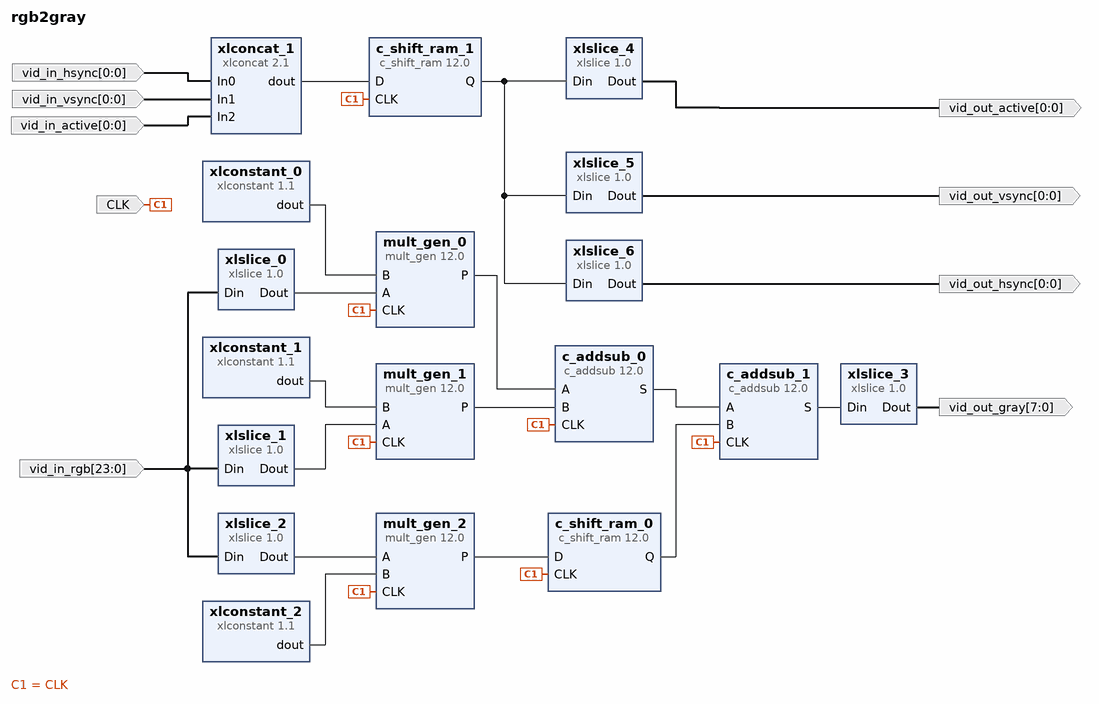
[diagram p0: block diagram of the top level]
# Vivado block design rgb2gray, Vivado 2015.2
create_bd_design rgb2gray

create_bd_port -dir I -type clk CLK
set_property -dict {CONFIG.FREQ_HZ 10000000} [get_bd_ports CLK]
create_bd_port -dir I -from 23 -to 0 vid_in_rgb
create_bd_port -dir I -from 0 -to 0 vid_in_hsync
create_bd_port -dir I -from 0 -to 0 vid_in_vsync
create_bd_port -dir I -from 0 -to 0 vid_in_active
create_bd_port -dir O -from 7 -to 0 vid_out_gray
create_bd_port -dir O -from 0 -to 0 vid_out_hsync
create_bd_port -dir O -from 0 -to 0 vid_out_vsync
create_bd_port -dir O -from 0 -to 0 vid_out_active

create_bd_cell -type ip -vlnv xilinx.com:ip:c_addsub:12.0 c_addsub_0
set_property -dict [list \
  CONFIG.A_Type Unsigned \
  CONFIG.B_Type Unsigned \
  CONFIG.A_Width 16 \
  CONFIG.B_Width 16 \
  CONFIG.Out_Width 16 \
  CONFIG.Latency 1 \
  CONFIG.B_Value 0000000000000000 \
  CONFIG.CE false \
] [get_bd_cells c_addsub_0]
create_bd_cell -type ip -vlnv xilinx.com:ip:c_addsub:12.0 c_addsub_1
set_property -dict [list \
  CONFIG.A_Type Unsigned \
  CONFIG.B_Type Unsigned \
  CONFIG.A_Width 16 \
  CONFIG.B_Width 16 \
  CONFIG.Out_Width 16 \
  CONFIG.Latency_Configuration Manual \
  CONFIG.Latency 1 \
  CONFIG.B_Value 0000000000000000 \
  CONFIG.CE false \
  CONFIG.SSET false \
  CONFIG.SINIT false \
  CONFIG.Bypass false \
] [get_bd_cells c_addsub_1]
create_bd_cell -type ip -vlnv xilinx.com:ip:c_shift_ram:12.0 c_shift_ram_0
set_property -dict {CONFIG.Depth 1} [get_bd_cells c_shift_ram_0]
create_bd_cell -type ip -vlnv xilinx.com:ip:c_shift_ram:12.0 c_shift_ram_1
set_property -dict {CONFIG.Width 3 CONFIG.Depth 3 CONFIG.DefaultData 000 CONFIG.AsyncInitVal 000} [get_bd_cells c_shift_ram_1]
create_bd_cell -type ip -vlnv xilinx.com:ip:mult_gen:12.0 mult_gen_0
set_property -dict [list \
  CONFIG.PortAType Unsigned \
  CONFIG.PortAWidth 8 \
  CONFIG.PortBType Unsigned \
  CONFIG.PortBWidth 8 \
  CONFIG.Multiplier_Construction Use_LUTs \
  CONFIG.OptGoal Speed \
  CONFIG.Use_Custom_Output_Width true \
  CONFIG.OutputWidthHigh 15 \
] [get_bd_cells mult_gen_0]
create_bd_cell -type ip -vlnv xilinx.com:ip:mult_gen:12.0 mult_gen_1
set_property -dict [list \
  CONFIG.PortAType Unsigned \
  CONFIG.PortAWidth 8 \
  CONFIG.PortBType Unsigned \
  CONFIG.PortBWidth 8 \
  CONFIG.Multiplier_Construction Use_LUTs \
  CONFIG.OptGoal Speed \
  CONFIG.Use_Custom_Output_Width true \
  CONFIG.OutputWidthHigh 15 \
] [get_bd_cells mult_gen_1]
create_bd_cell -type ip -vlnv xilinx.com:ip:mult_gen:12.0 mult_gen_2
set_property -dict [list \
  CONFIG.PortAType Unsigned \
  CONFIG.PortAWidth 8 \
  CONFIG.PortBType Unsigned \
  CONFIG.PortBWidth 8 \
  CONFIG.Multiplier_Construction Use_LUTs \
  CONFIG.OptGoal Speed \
  CONFIG.Use_Custom_Output_Width true \
  CONFIG.OutputWidthHigh 15 \
] [get_bd_cells mult_gen_2]
create_bd_cell -type ip -vlnv xilinx.com:ip:xlconcat:2.1 xlconcat_1
set_property -dict {CONFIG.NUM_PORTS 3} [get_bd_cells xlconcat_1]
create_bd_cell -type ip -vlnv xilinx.com:ip:xlconstant:1.1 xlconstant_0
set_property -dict {CONFIG.CONST_WIDTH 8 CONFIG.CONST_VAL 77} [get_bd_cells xlconstant_0]
create_bd_cell -type ip -vlnv xilinx.com:ip:xlconstant:1.1 xlconstant_1
set_property -dict {CONFIG.CONST_WIDTH 8 CONFIG.CONST_VAL 150} [get_bd_cells xlconstant_1]
create_bd_cell -type ip -vlnv xilinx.com:ip:xlconstant:1.1 xlconstant_2
set_property -dict {CONFIG.CONST_WIDTH 8 CONFIG.CONST_VAL 29} [get_bd_cells xlconstant_2]
create_bd_cell -type ip -vlnv xilinx.com:ip:xlslice:1.0 xlslice_0
set_property -dict {CONFIG.DOUT_WIDTH 8 CONFIG.DIN_TO 16 CONFIG.DIN_FROM 23 CONFIG.DIN_WIDTH 24} [get_bd_cells xlslice_0]
create_bd_cell -type ip -vlnv xilinx.com:ip:xlslice:1.0 xlslice_1
set_property -dict {CONFIG.DOUT_WIDTH 8 CONFIG.DIN_TO 8 CONFIG.DIN_FROM 15 CONFIG.DIN_WIDTH 24} [get_bd_cells xlslice_1]
create_bd_cell -type ip -vlnv xilinx.com:ip:xlslice:1.0 xlslice_2
set_property -dict {CONFIG.DOUT_WIDTH 8 CONFIG.DIN_TO 0 CONFIG.DIN_FROM 7 CONFIG.DIN_WIDTH 24} [get_bd_cells xlslice_2]
create_bd_cell -type ip -vlnv xilinx.com:ip:xlslice:1.0 xlslice_3
set_property -dict {CONFIG.DOUT_WIDTH 8 CONFIG.DIN_TO 8 CONFIG.DIN_FROM 15 CONFIG.DIN_WIDTH 16} [get_bd_cells xlslice_3]
create_bd_cell -type ip -vlnv xilinx.com:ip:xlslice:1.0 xlslice_4
set_property -dict {CONFIG.DOUT_WIDTH 1 CONFIG.DIN_TO 2 CONFIG.DIN_FROM 2 CONFIG.DIN_WIDTH 3} [get_bd_cells xlslice_4]
create_bd_cell -type ip -vlnv xilinx.com:ip:xlslice:1.0 xlslice_5
set_property -dict {CONFIG.DOUT_WIDTH 1 CONFIG.DIN_TO 1 CONFIG.DIN_FROM 1 CONFIG.DIN_WIDTH 3} [get_bd_cells xlslice_5]
create_bd_cell -type ip -vlnv xilinx.com:ip:xlslice:1.0 xlslice_6
set_property -dict {CONFIG.DOUT_WIDTH 1 CONFIG.DIN_TO 0 CONFIG.DIN_FROM 0 CONFIG.DIN_WIDTH 3} [get_bd_cells xlslice_6]

# ---- connections ----

connect_bd_net [get_bd_ports CLK] \
  [get_bd_pins c_addsub_0/CLK] [get_bd_pins c_addsub_1/CLK] [get_bd_pins c_shift_ram_0/CLK] [get_bd_pins c_shift_ram_1/CLK] \
  [get_bd_pins mult_gen_0/CLK] [get_bd_pins mult_gen_1/CLK] [get_bd_pins mult_gen_2/CLK]
connect_bd_net -net Din_1 [get_bd_ports vid_in_rgb] [get_bd_pins xlslice_0/Din] [get_bd_pins xlslice_1/Din] [get_bd_pins xlslice_2/Din]
connect_bd_net -net In0_1 [get_bd_ports vid_in_hsync] [get_bd_pins xlconcat_1/In0]
connect_bd_net -net In1_1 [get_bd_ports vid_in_vsync] [get_bd_pins xlconcat_1/In1]
connect_bd_net -net In2_1 [get_bd_ports vid_in_active] [get_bd_pins xlconcat_1/In2]
connect_bd_net [get_bd_pins c_addsub_0/S] [get_bd_pins c_addsub_1/A]
connect_bd_net [get_bd_pins c_shift_ram_0/Q] [get_bd_pins c_addsub_1/B]
connect_bd_net [get_bd_pins c_shift_ram_1/Q] [get_bd_pins xlslice_4/Din] [get_bd_pins xlslice_5/Din] [get_bd_pins xlslice_6/Din]
connect_bd_net [get_bd_pins xlconcat_1/dout] [get_bd_pins c_shift_ram_1/D]
connect_bd_net [get_bd_pins xlconstant_0/dout] [get_bd_pins mult_gen_0/B]
connect_bd_net [get_bd_pins xlconstant_1/dout] [get_bd_pins mult_gen_1/B]
connect_bd_net [get_bd_pins xlconstant_2/dout] [get_bd_pins mult_gen_2/B]
connect_bd_net [get_bd_pins xlslice_0/Dout] [get_bd_pins mult_gen_0/A]
connect_bd_net [get_bd_pins xlslice_1/Dout] [get_bd_pins mult_gen_1/A]
connect_bd_net [get_bd_pins xlslice_2/Dout] [get_bd_pins mult_gen_2/A]
connect_bd_net [get_bd_pins xlslice_3/Dout] [get_bd_ports vid_out_gray]
connect_bd_net [get_bd_pins xlslice_5/Dout] [get_bd_ports vid_out_vsync]
connect_bd_net [get_bd_pins mult_gen_2/P] [get_bd_pins c_shift_ram_0/D]
connect_bd_net [get_bd_pins c_addsub_1/S] [get_bd_pins xlslice_3/Din]
connect_bd_net [get_bd_pins mult_gen_0/P] [get_bd_pins c_addsub_0/A]
connect_bd_net [get_bd_pins mult_gen_1/P] [get_bd_pins c_addsub_0/B]
connect_bd_net [get_bd_pins xlslice_4/Dout] [get_bd_ports vid_out_active]
connect_bd_net [get_bd_pins xlslice_6/Dout] [get_bd_ports vid_out_hsync]

validate_bd_design
save_bd_design
